# Altium project RX_Banda_Aerea.PrjPCB
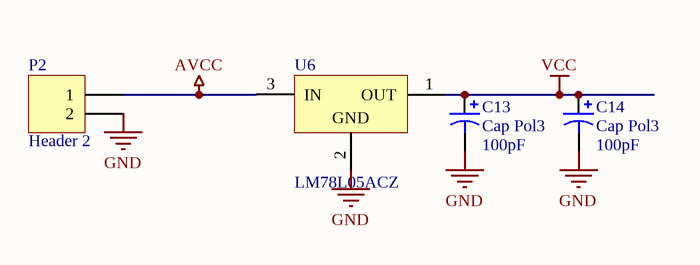
[diagram p0: Alimentacion.SchDoc]
7 sheets, 133 parts. Net scope: flat (ports and power ports of the same name join across sheets).
Board file: RX_Banda_Aerea.PcbDoc
Sheets:
  Alimentacion.SchDoc
  FiltroRF.SchDoc
  Ampli_RF.SchDoc
  Mezclador1.SchDoc
  Mezclador2.SchDoc
  Ampli_FI2.SchDoc
  Ampli_audio.SchDoc

## Sheet Alimentacion.SchDoc
size A4

### Parts
C13  Cap Pol3  value 100pF  [C0805]
C14  Cap Pol3  value 100pF  [C0805]
P2  Header 2  [HDR1X2]
U6  LM78L05ACZ  [Z03A]

### Nets
AVCC: P2.1 U6.3(IN)
GND: C13.2 C14.2 P2.2 U6.2(GND)
VCC: C13.1 C14.1 U6.1(OUT)

### Library data of the parts
C13 C14 = Cap Pol3: Polarized Capacitor (Surface Mount); Published: 8-Jun-2000; LatestRevisionDate: 17-Jul-2002; LatestRevisionNote: Re-released for DXP Platform.; PackageReference: C0805; Publisher: Altium Limited
P2 = Header 2: Header, 2-Pin; LatestRevisionDate: 17-Jul-2002; LatestRevisionNote: Re-released for DXP Platform.; Publisher: Altium Limited
U6 = LM78L05ACZ: 3-Terminal Positive Regulators; Manufacturer: National Semiconductor; CompType: LDO IC; PackageTopMarking: NSXYTT*LM78L*05ACZ; Published: 27-Nov-2008; DatasheetVersion: Apr-2006; PackageVersion: revG, Sep-2000; PackageReference: Z03A; Publisher: Altium Limited; PackageDescription: TO-92, Molded, 3 Lead; PartNumber: LM78L05ACZ; RoHS: O; PinCount: 3; DigiKeyPartNumber: LM78L05ACZNS-ND; Code_JEDEC: TO-226-AA; ComponentLink1Description: LM78L05 Datasheet; ComponentLink1URL: http://www.national.com/ds/LM/LM78L05.pdf; ComponentLink2Description: LM78L05 Web Page; ComponentLink2URL: http://www.national.com/pf/LM/LM78L05.html; ComponentLink3Description: Z03A Package Page; ComponentLink3URL: http://www.national.com/packaging/folders/z03a.html

## Sheet FiltroRF.SchDoc
size A4
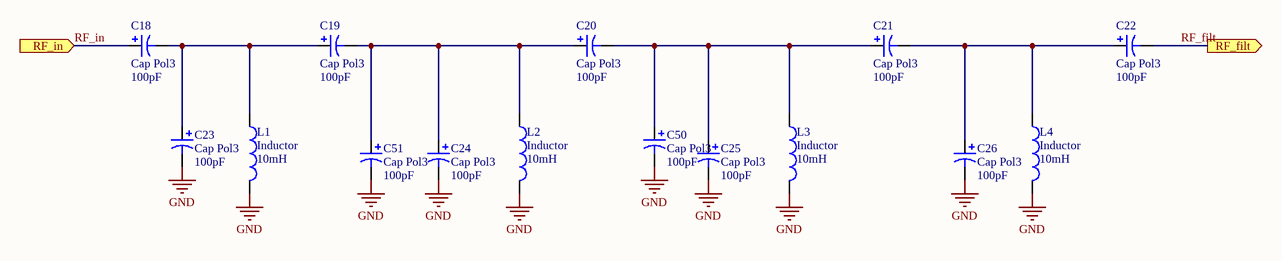
[diagram p1: FiltroRF.SchDoc]

### Parts
C18  Cap Pol3  value 100pF  [C0805]
C19  Cap Pol3  value 100pF  [C0805]
C20  Cap Pol3  value 100pF  [C0805]
C21  Cap Pol3  value 100pF  [C0805]
C22  Cap Pol3  value 100pF  [C0805]
C23  Cap Pol3  value 100pF  [C0805]
C24  Cap Pol3  value 100pF  [C0805]
C25  Cap Pol3  value 100pF  [C0805]
C26  Cap Pol3  value 100pF  [C0805]
C50  Cap Pol3  value 100pF  [C0805]
C51  Cap Pol3  value 100pF  [C0805]
L1  Inductor  value 10mH  [3261]
L2  Inductor  value 10mH  [3261]
L3  Inductor  value 10mH  [3261]
L4  Inductor  value 10mH  [3261]

### Ports
RF_filt (out), RF_in (in)

### Nets
GND: C23.2 C24.2 C25.2 C26.2 C50.2 C51.2 L1.2 L2.2 L3.2 L4.2
RF_filt: C22.2 ; port RF_filt
RF_in: C18.1 ; port RF_in
NetC18_2: C18.2 C19.1 C23.1 L1.1
NetC19_2: C19.2 C20.1 C24.1 C51.1 L2.1
NetC20_2: C20.2 C21.1 C25.1 C50.1 L3.1
NetC21_2: C21.2 C22.1 C26.1 L4.1

### Library data of the parts
C18-C26 C50 C51 = Cap Pol3: Polarized Capacitor (Surface Mount); Published: 8-Jun-2000; LatestRevisionDate: 17-Jul-2002; LatestRevisionNote: Re-released for DXP Platform.; PackageReference: C0805; Publisher: Altium Limited
L1-L4 = Inductor: Code_IEC: 1005; Published: 8-Jun-2000; LatestRevisionDate: 17-Jul-2002; LatestRevisionNote: Re-released for DXP Platform.; PackageReference: 0402-A; Publisher: Altium Limited; Code_JEITA: 0402

## Sheet Ampli_RF.SchDoc
size A4
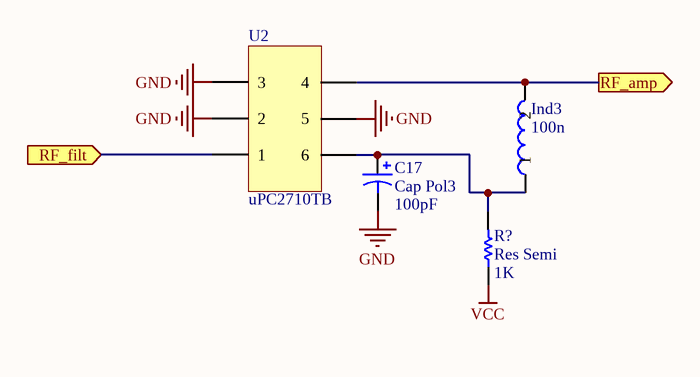
[diagram p2: Ampli_RF.SchDoc]

### Parts
(Parts that share a designator on the sheet are numbered #1, #2 ... from top to bottom, then left to right.)
C17  Cap Pol3  value 100pF  [C0805]
Ind3  Valor: 100n  [NTH12_2]  (hidden comment: Ind2)
R?#1  Res Semi  value 1K  [2012[0805]]
U2  uPC2710TB  [UPC2710TB2]

### Ports
RF_amp (out), RF_filt (in)

### Nets
GND: C17.2 U2.GND1(2) U2.GND2(3) U2.GND3(5)
VCC: R?#1.1
RF_amp: Ind3.2 U2.RF_OUT(4) ; port RF_amp
RF_filt: U2.RF_IN(1) ; port RF_filt
NetC17_1: C17.1 Ind3.1 R?#1.2 U2.Vcc(6)

### Library data of the parts
C17 = Cap Pol3: Polarized Capacitor (Surface Mount); Published: 8-Jun-2000; LatestRevisionDate: 17-Jul-2002; LatestRevisionNote: Re-released for DXP Platform.; PackageReference: C0805; Publisher: Altium Limited
R?#1 = Res Semi: Semiconductor Resistor; Published: 8-Jun-2000; LatestRevisionDate: 17-Jul-2002; LatestRevisionNote: Re-released for DXP Platform.; PackageReference: AXIAL-0.5; Publisher: Altium Limited
U2 = uPC2710TB: pin to pad: GND1>2 GND2>3 GND3>5 RF_IN>1 RF_OUT>4 Vcc>6

## Sheet Mezclador1.SchDoc
size A4
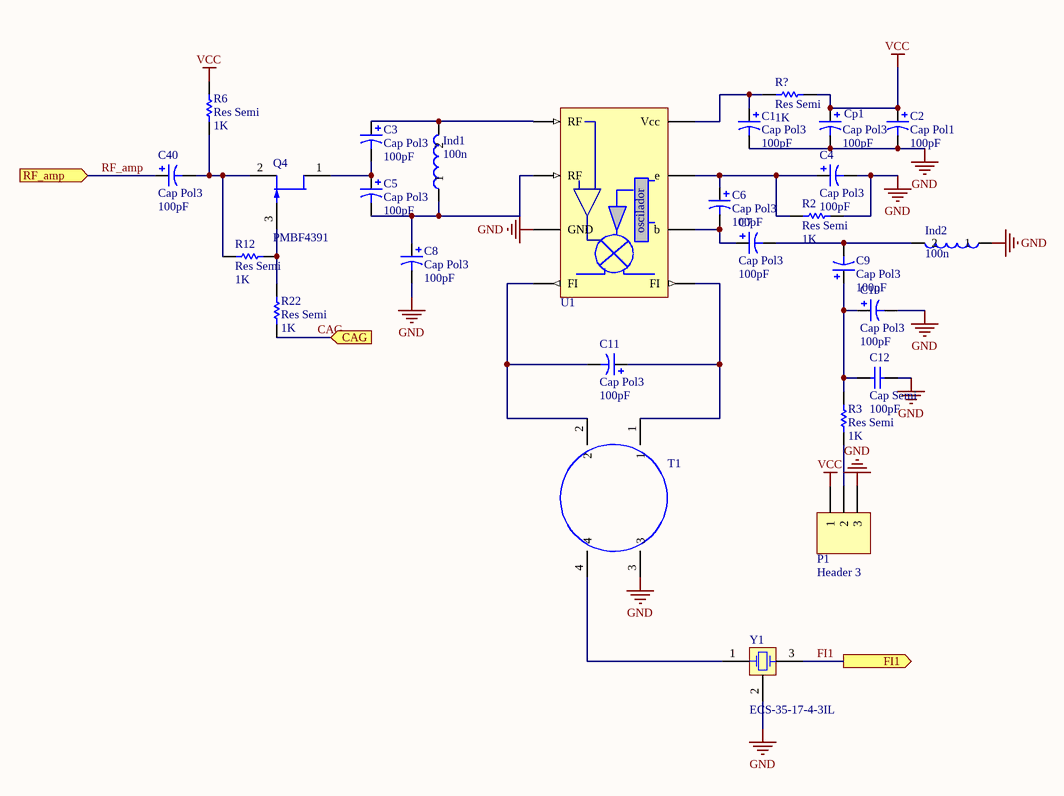
[diagram p3: Mezclador1.SchDoc]

### Parts
(Parts that share a designator on the sheet are numbered #1, #2 ... from top to bottom, then left to right.)
C1  Cap Pol3  value 100pF  [C0805]
C2  Cap Pol1  value 100pF  [B]
C3  Cap Pol3  value 100pF  [C0805]
C4  Cap Pol3  value 100pF  [C0805]
C5  Cap Pol3  value 100pF  [C0805]
C6  Cap Pol3  value 100pF  [C0805]
C7  Cap Pol3  value 100pF  [C0805]
C8  Cap Pol3  value 100pF  [C0805]
C9  Cap Pol3  value 100pF  [C0805]
C10  Cap Pol3  value 100pF  [C0805]
C11  Cap Pol3  value 100pF  [C0805]
C12  Cap Semi  value 100pF  [C1206]
C40  Cap Pol3  value 100pF  [C0805]
Cp1  Cap Pol3  value 100pF  [C0805]
Ind1  Valor: 100n  [Ind_5mm]  (hidden comment: Ind2)
Ind2  Valor: 100n  [Ind_4mm]  (hidden comment: Ind2)
P1  Header 3  [HDR1X3]
Q4  PMBF4391  [SOT23_N]
R2  Res Semi  value 1K  [2012[0805]]
R3  Res Semi  value 1K  [2012[0805]]
R6  Res Semi  value 1K  [2012[0805]]
R12  Res Semi  value 1K  [2012[0805]]
R22  Res Semi  value 1K  [2012[0805]]
R?#2  Res Semi  value 1K  [2012[0805]]
T1  Toroide  [NTH12_4]  (value not drawn)
U1  SA602  [SA602]  (value not drawn)
Y1  ECS-35-17-4-3IL  [HC-49US]

### Ports
CAG (in), FI1 (out), RF_amp (in)

### Nets
GND: C1.2 C2.2 C4.2 C8.2 C10.2 C12.2 Cp1.2 Ind2.1 P1.3 R2.1 T1.3 U1.3(GND) Y1.2(COM)
VCC: C2.1 Cp1.1 P1.1 R6.2 R?#2.2
CAG: R22.2 ; port CAG
FI1: Y1.3(OSC2) ; port FI1
RF_amp: C40.1 ; port RF_amp
NetC1_1: C1.1 R?#2.1 U1.8(Vcc)
NetC3_1: C3.1 Ind1.2 U1.1(RF)
NetC3_2: C3.2 C5.1 Q4.1(D)
NetC4_1: C4.1 C6.1 R2.2 U1.7(e)
NetC5_2: C5.2 C8.1 Ind1.1 U1.2(RF)
NetC6_2: C6.2 C7.1 U1.6(b)
NetC7_2: C7.2 C9.2 Ind2.2
NetC9_1: C9.1 C10.1 C12.1 R3.2
NetC11_1: C11.1 T1.1 U1.5(FI)
NetC11_2: C11.2 T1.2 U1.4(FI)
NetC40_2: C40.2 Q4.2(S) R6.1 R12.1
NetP1_2: P1.2 R3.1
NetQ4_3: Q4.3(G) R12.2 R22.1
NetT1_4: T1.4 Y1.1(OSC1)

### Notes on the sheet
- (in symbol SA602A) oscilador

### Library data of the parts
C1 C3-C11 C40 Cp1 = Cap Pol3: Polarized Capacitor (Surface Mount); Published: 8-Jun-2000; LatestRevisionDate: 17-Jul-2002; LatestRevisionNote: Re-released for DXP Platform.; PackageReference: C0805; Publisher: Altium Limited
C2 = Cap Pol1: Polarized Capacitor (Radial); Published: 8-Jun-2000; LatestRevisionDate: 17-Jul-2002; LatestRevisionNote: Re-released for DXP Platform.; PackageReference: RB7.6-15; Publisher: Altium Limited
C12 = Cap Semi: Capacitor (Semiconductor SIM Model); Published: 8-Jun-2000; LatestRevisionDate: 17-Jul-2002; LatestRevisionNote: Re-released for DXP Platform.; PackageReference: C1206; Publisher: Altium Limited
P1 = Header 3: Header, 3-Pin; LatestRevisionDate: 17-Jul-2002; LatestRevisionNote: Re-released for DXP Platform.; Publisher: Altium Limited
Q4 = PMBF4391: N-channel Silicon Junction Field-effect Transistor; Published: 17-Sep-2003; LatestRevisionDate: 12-Dec-2006; LatestRevisionNote: IPC-7351 Footprint Added.; DatasheetVersion: Apr-1995; PackageVersion: May-1999; PackageReference: SOT23; Publisher: Altium Limited; PackageDescription: 3-Pin SOT-23 Package 0.95 mm Pitch, 2.3 mm Lead Span; ComponentLink1Description: Manufacturer Link; ComponentLink1URL: http://www.semiconductors.philips.com/; ComponentLink2Description: Datasheet; ComponentLink2URL: http://www.semiconductors.philips.com/acrobat/datasheets/PMBF4391_4392_4393_CNV_2.pdf
R2 R3 R6 R12 R22 R?#2 = Res Semi: Semiconductor Resistor; Published: 8-Jun-2000; LatestRevisionDate: 17-Jul-2002; LatestRevisionNote: Re-released for DXP Platform.; PackageReference: AXIAL-0.5; Publisher: Altium Limited
T1 = Transformador_Toroide
U1 = SA602A: Mezclador 500MHz
Y1 = ECS-35-17-4-3IL: Crystal Oscillator, 3rd In-Line Lead Version; Published: 17-Jul-2002; DatasheetDocument: 18-Apr-2000; PackageReference: HC-49US; Publisher: Altium Limited; ComponentLink1Description: Manufacturer Link; ComponentLink1URL: http://www.ecsxtal.com/; ComponentLink2Description: Datasheet; ComponentLink2URL: http://www.ecsxtal.com/pdf3/HC_49US.pdf

## Sheet Mezclador2.SchDoc
size A4
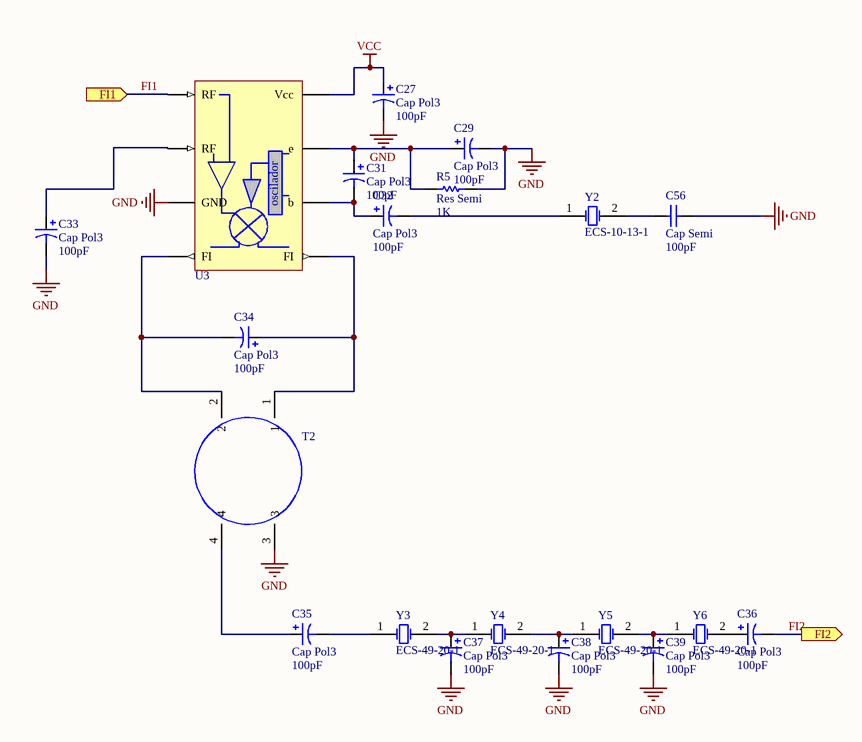
[diagram p4: Mezclador2.SchDoc]

### Parts
C27  Cap Pol3  value 100pF  [C0805]
C29  Cap Pol3  value 100pF  [C0805]
C31  Cap Pol3  value 100pF  [C0805]
C32  Cap Pol3  value 100pF  [C0805]
C33  Cap Pol3  value 100pF  [C0805]
C34  Cap Pol3  value 100pF  [C0805]
C35  Cap Pol3  value 100pF  [C0805]
C36  Cap Pol3  value 100pF  [C0805]
C37  Cap Pol3  value 100pF  [C0805]
C38  Cap Pol3  value 100pF  [C0805]
C39  Cap Pol3  value 100pF  [C0805]
C56  Cap Semi  value 100pF  [C1206]
R5  Res Semi  value 1K  [2012[0805]]
T2  Toroide  [NTH12_4]  (value not drawn)
U3  SA602  [SA602]  (value not drawn)
Y2  ECS-10-13-1  [HC-49U]
Y3  ECS-49-20-1  [HC-49U]
Y4  ECS-49-20-1  [HC-49U]
Y5  ECS-49-20-1  [HC-49U]
Y6  ECS-49-20-1  [HC-49U]

### Ports
FI1 (in), FI2 (out)

### Nets
GND: C27.2 C29.2 C33.2 C37.2 C38.2 C39.2 C56.2 R5.1 T2.3 U3.3(GND)
VCC: C27.1 U3.8(Vcc)
FI1: U3.1(RF) ; port FI1
FI2: C36.2 ; port FI2
NetC29_1: C29.1 C31.1 R5.2 U3.7(e)
NetC31_2: C31.2 C32.1 U3.6(b)
NetC32_2: C32.2 Y2.1(OSC1)
NetC33_1: C33.1 U3.2(RF)
NetC34_1: C34.1 T2.1 U3.5(FI)
NetC34_2: C34.2 T2.2 U3.4(FI)
NetC35_1: C35.1 T2.4
NetC35_2: C35.2 Y3.1(OSC1)
NetC36_1: C36.1 Y6.2(OSC2)
NetC37_1: C37.1 Y3.2(OSC2) Y4.1(OSC1)
NetC38_1: C38.1 Y4.2(OSC2) Y5.1(OSC1)
NetC39_1: C39.1 Y5.2(OSC2) Y6.1(OSC1)
NetC56_1: C56.1 Y2.2(OSC2)

### Notes on the sheet
- (in symbol SA602A) oscilador

### Library data of the parts
C27 C29 C31-C39 = Cap Pol3: Polarized Capacitor (Surface Mount); Published: 8-Jun-2000; LatestRevisionDate: 17-Jul-2002; LatestRevisionNote: Re-released for DXP Platform.; PackageReference: C0805; Publisher: Altium Limited
C56 = Cap Semi: Capacitor (Semiconductor SIM Model); Published: 8-Jun-2000; LatestRevisionDate: 17-Jul-2002; LatestRevisionNote: Re-released for DXP Platform.; PackageReference: C1206; Publisher: Altium Limited
R5 = Res Semi: Semiconductor Resistor; Published: 8-Jun-2000; LatestRevisionDate: 17-Jul-2002; LatestRevisionNote: Re-released for DXP Platform.; PackageReference: AXIAL-0.5; Publisher: Altium Limited
T2 = Transformador_Toroide
U3 = SA602A: Mezclador 500MHz
Y2 = ECS-10-13-1: Crystal Oscillator; Published: 17-Jul-2002; DatasheetDocument: 18-Apr-2000; PackageReference: HC-49U; Publisher: Altium Limited; ComponentLink1Description: Manufacturer Link; ComponentLink1URL: http://www.ecsxtal.com/; ComponentLink2Description: Datasheet; ComponentLink2URL: http://www.ecsxtal.com/pdf2/HC49U.PDF
Y3-Y6 = ECS-49-20-1: Crystal Oscillator; Published: 17-Jul-2002; DatasheetDocument: 18-Apr-2000; PackageReference: HC-49U; Publisher: Altium Limited; ComponentLink1Description: Manufacturer Link; ComponentLink1URL: http://www.ecsxtal.com/; ComponentLink2Description: Datasheet; ComponentLink2URL: http://www.ecsxtal.com/pdf2/HC49U.PDF

## Sheet Ampli_FI2.SchDoc
size A4
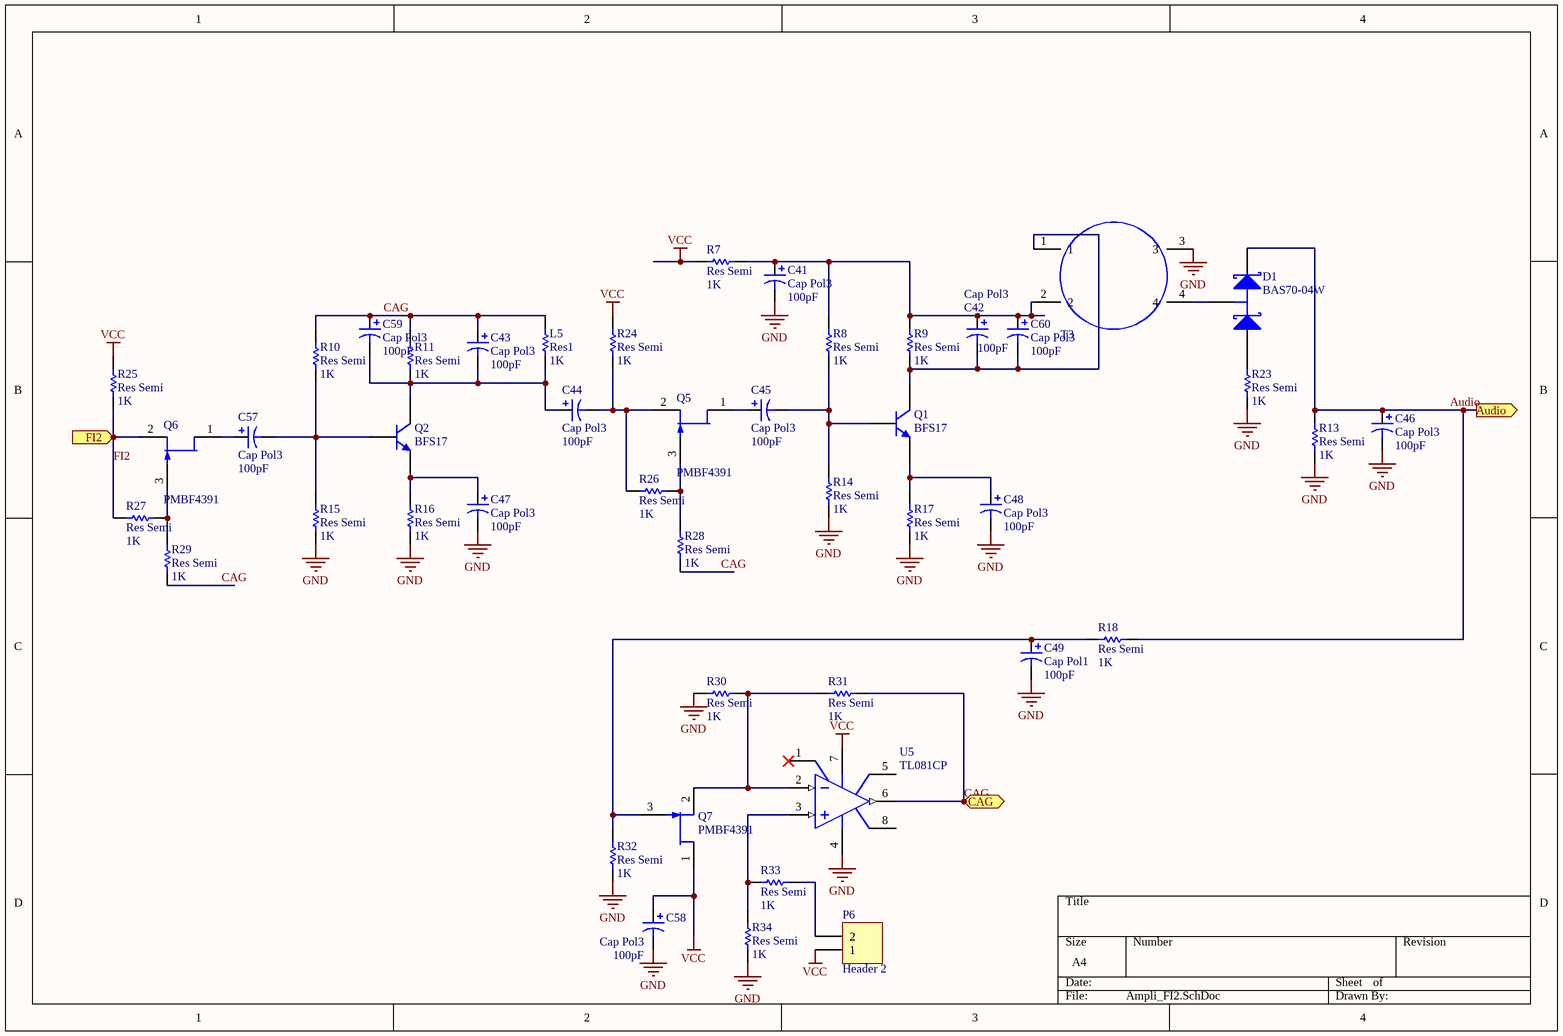
[diagram p5: Ampli_FI2.SchDoc]

### Parts
C41  Cap Pol3  value 100pF  [C0805]
C42  Cap Pol3  value 100pF  [C0805]
C43  Cap Pol3  value 100pF  [C0805]
C44  Cap Pol3  value 100pF  [C0805]
C45  Cap Pol3  value 100pF  [C0805]
C46  Cap Pol3  value 100pF  [C0805]
C47  Cap Pol3  value 100pF  [C0805]
C48  Cap Pol3  value 100pF  [C0805]
C49  Cap Pol1  value 100pF  [B]
C57  Cap Pol3  value 100pF  [C0805]
C58  Cap Pol3  value 100pF  [C0805]
C59  Cap Pol3  value 100pF  [C0805]
C60  Cap Pol3  value 100pF  [C0805]
D1  BAS70-04W  [SOT323_N]
L5  Res1  value 1K  [AXIAL-0.3]
P6  Header 2  [HDR1X2]
Q1  BFS17  [SOT23_N]
Q2  BFS17  [SOT23_N]
Q5  PMBF4391  [SOT23_N]
Q6  PMBF4391  [SOT23_N]
Q7  PMBF4391  [SOT23_N]
R7  Res Semi  value 1K  [2012[0805]]
R8  Res Semi  value 1K  [2012[0805]]
R9  Res Semi  value 1K  [2012[0805]]
R10  Res Semi  value 1K  [2012[0805]]
R11  Res Semi  value 1K  [2012[0805]]
R13  Res Semi  value 1K  [2012[0805]]
R14  Res Semi  value 1K  [2012[0805]]
R15  Res Semi  value 1K  [2012[0805]]
R16  Res Semi  value 1K  [2012[0805]]
R17  Res Semi  value 1K  [2012[0805]]
R18  Res Semi  value 1K  [2012[0805]]
R23  Res Semi  value 1K  [2012[0805]]
R24  Res Semi  value 1K  [2012[0805]]
R25  Res Semi  value 1K  [2012[0805]]
R26  Res Semi  value 1K  [2012[0805]]
R27  Res Semi  value 1K  [2012[0805]]
R28  Res Semi  value 1K  [2012[0805]]
R29  Res Semi  value 1K  [2012[0805]]
R30  Res Semi  value 1K  [2012[0805]]
R31  Res Semi  value 1K  [2012[0805]]
R32  Res Semi  value 1K  [2012[0805]]
R33  Res Semi  value 1K  [2012[0805]]
R34  Res Semi  value 1K  [2012[0805]]
T3  Toroide  [NTH12_4]  (value not drawn)
U5  TL081CP  [626-05]

### Ports
Audio (out), CAG (out), FI2 (in)

### Nets
GND: C41.2 C46.2 C47.2 C48.2 C49.2 C58.2 R13.1 R14.2 R15.1 R16.1 R17.2 R23.1 R30.1 R32.2 R34.2 T3.3 U5.4(V-)
VCC: C58.1 P6.1 Q7.1(D) R7.2 R24.2 R25.1 U5.7(V+)
Audio: C46.1 D1.2(K) R13.2 R18.1 ; port Audio
CAG: C43.1 C59.1 L5.2 R10.2 R11.2 R28.2 R29.2 R31.2 U5.6(OUT) ; port CAG
FI2: Q6.2(S) R25.2 R27.1 ; port FI2
NetC41_1: C41.1 C42.1 C60.1 R7.1 R8.1 R9.1 T3.2
NetC42_2: C42.2 C60.2 Q1.3(C) R9.2 T3.1
NetC43_2: C43.2 C44.1 C59.2 L5.1 Q2.3(C) R11.1
NetC44_2: C44.2 Q5.2(S) R24.1 R26.1
NetC45_1: C45.1 Q5.1(D)
NetC45_2: C45.2 Q1.1(B) R8.2 R14.1
NetC47_1: C47.1 Q2.2(E) R16.2
NetC48_1: C48.1 Q1.2(E) R17.1
NetC49_1: C49.1 Q7.3(G) R18.2 R32.1
NetC57_1: C57.1 Q6.1(D)
NetC57_2: C57.2 Q2.1(B) R10.1 R15.2
NetD1_1: D1.1(A) R23.2
NetD1_3: D1.3(C) T3.4
NetP6_2: P6.2 R33.1
NetQ5_3: Q5.3(G) R26.2 R28.1
NetQ6_3: Q6.3(G) R27.2 R29.1
NetQ7_2: Q7.2(S) R30.2 R31.1 U5.2(IN-)
NetR33_2: R33.2 R34.1 U5.3(IN+)

Not connected (* = marked no-connect by the designer): U5 1(OS_NULL)* 5(OS_NULL) 8(NC)

### Library data of the parts
C41-C48 C57-C60 = Cap Pol3: Polarized Capacitor (Surface Mount); Published: 8-Jun-2000; LatestRevisionDate: 17-Jul-2002; LatestRevisionNote: Re-released for DXP Platform.; PackageReference: C0805; Publisher: Altium Limited
C49 = Cap Pol1: Polarized Capacitor (Radial); Published: 8-Jun-2000; LatestRevisionDate: 17-Jul-2002; LatestRevisionNote: Re-released for DXP Platform.; PackageReference: RB7.6-15; Publisher: Altium Limited
D1 = BAS70-04W: Schottky Barrier Double Diode; Published: 17-Sep-2003; LatestRevisionDate: 12-Dec-2006; LatestRevisionNote: IPC-7351 Footprint Added.; DatasheetVersion: 26-Mar-1999; PackageVersion: Apr-1999; PackageReference: SOT323; Publisher: Altium Limited; PackageDescription: 3-Pin SOT-323 Package 0.65 mm Pitch, 2.1 mm Lead Span; ComponentLink1Description: Manufacturer Link; ComponentLink1URL: http://www.semiconductors.philips.com/; ComponentLink2Description: Datasheet; ComponentLink2URL: http://www.semiconductors.philips.com/acrobat/datasheets/BAS70W_3.pdf
L5 = Res1: Resistor; Published: 8-Jun-2000; LatestRevisionDate: 17-Jul-2002; LatestRevisionNote: Re-released for DXP Platform.; PackageReference: AXIAL-0.3; Publisher: Altium Limited
P6 = Header 2: Header, 2-Pin; LatestRevisionDate: 17-Jul-2002; LatestRevisionNote: Re-released for DXP Platform.; Publisher: Altium Limited
Q1 Q2 = BFS17: NPN 1 GHz Wideband Transistor; Published: 17-Sep-2003; LatestRevisionDate: 12-Dec-2006; LatestRevisionNote: IPC-7351 Footprint Added.; DatasheetVersion: Sep-1995; PackageVersion: May-1999; PackageReference: SOT23; Publisher: Altium Limited; PackageDescription: 3-Pin SOT-23 Package 0.95 mm Pitch, 2.3 mm Lead Span; ComponentLink1Description: Manufacturer Link; ComponentLink1URL: http://www.semiconductors.philips.com/; ComponentLink2Description: Datasheet; ComponentLink2URL: http://www.semiconductors.philips.com/acrobat/datasheets/BFS17_2.pdf
Q5-Q7 = PMBF4391: as Q4 on sheet Mezclador1; Published: 17-Sep-2003; LatestRevisionDate: 12-Dec-2006; LatestRevisionNote: IPC-7351 Footprint Added.; DatasheetVersion: Apr-1995; PackageVersion: May-1999; PackageReference: SOT23; Publisher: Altium Limited; PackageDescription: 3-Pin SOT-23 Package 0.95 mm Pitch, 2.3 mm Lead Span; ComponentLink1Description: Manufacturer Link; ComponentLink1URL: http://www.semiconductors.philips.com/; ComponentLink2Description: Datasheet; ComponentLink2URL: http://www.semiconductors.philips.com/acrobat/datasheets/PMBF4391_4392_4393_CNV_2.pdf
R7-R11 R13-R18 R23-R34 = Res Semi: Semiconductor Resistor; Published: 8-Jun-2000; LatestRevisionDate: 17-Jul-2002; LatestRevisionNote: Re-released for DXP Platform.; PackageReference: AXIAL-0.5; Publisher: Altium Limited
T3 = Transformador_Toroide
U5 = TL081CP: JFET-Input Operational Amplifier; Published: 17-Jul-2002; LatestRevisionDate: 06-Jun-2005; LatestRevisionNote: Stylized 3D Model Added.; DatasheetVersion: 1988; PackageReference: 626-05; Publisher: Altium Limited; PackageDescription: DIP; 8 Leads; Row Spacing 7.62 mm; Pitch 2.54 mm; ComponentLink1Description: Manufacturer Link; ComponentLink1URL: http://www.onsemi.com/site/products/parametrics/0,4446,251,00.html

## Sheet Ampli_audio.SchDoc
size A4
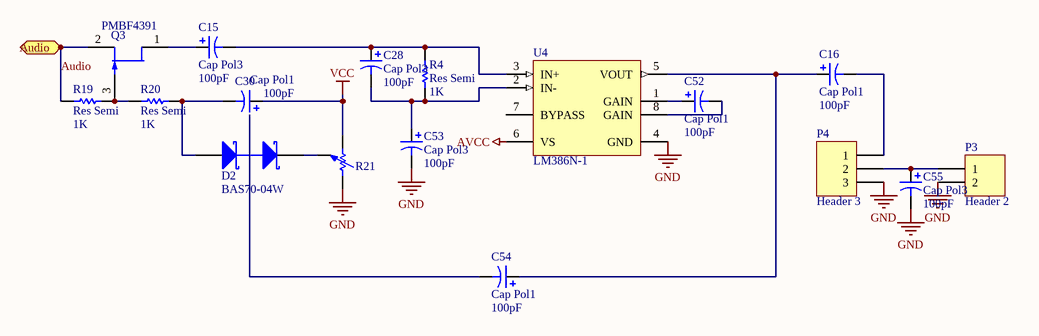
[diagram p6: Ampli_audio.SchDoc]

### Parts
C15  Cap Pol3  value 100pF  [C0805]
C16  Cap Pol1  value 100pF  [B]
C28  Cap Pol3  value 100pF  [C0805]
C30  Cap Pol1  value 100pF  [B]
C52  Cap Pol1  value 100pF  [B]
C53  Cap Pol3  value 100pF  [C0805]
C54  Cap Pol1  value 100pF  [B]
C55  Cap Pol3  value 100pF  [C0805]
D2  BAS70-04W  [SOT323_N]
P3  Header 2  [HDR1X2]
P4  Header 3  [HDR1X3]
Q3  PMBF4391  [SOT23_N]
R4  Res Semi  value 1K  [2012[0805]]
R19  Res Semi  value 1K  [2012[0805]]
R20  Res Semi  value 1K  [2012[0805]]
R21  Pot  [Potenciometro]  (value not drawn)
U4  LM386N-1  [N08E]

### Ports
Audio (in)

### Nets
AVCC: U4.6(VS)
GND: C53.2 C55.2 P3.2 P4.3 R21.1 U4.4(GND)
VCC: C30.1 R21.2
Audio: Q3.2(S) R19.1 ; port Audio
NetC15_1: C15.1 Q3.1(D)
NetC15_2: C15.2 C28.1 R4.2 U4.3(IN+)
NetC16_1: C16.1 C54.1 U4.5(VOUT)
NetC16_2: C16.2 P4.1
NetC28_2: C28.2 C53.1 R4.1 U4.2(IN-)
NetC30_2: C30.2 D2.1(A) R20.2
NetC52_1: C52.1 U4.1(GAIN)
NetC52_2: C52.2 U4.8(GAIN)
NetC54_2: C54.2 D2.3(C)
NetC55_1: C55.1 P3.1 P4.2
NetD2_2: D2.2(K) R21.3
NetQ3_3: Q3.3(G) R19.2 R20.1

Not connected (* = marked no-connect by the designer): U4 7(BYPASS)

### Library data of the parts
C15 C28 C53 C55 = Cap Pol3: Polarized Capacitor (Surface Mount); Published: 8-Jun-2000; LatestRevisionDate: 17-Jul-2002; LatestRevisionNote: Re-released for DXP Platform.; PackageReference: C0805; Publisher: Altium Limited
C16 C30 C52 C54 = Cap Pol1: Polarized Capacitor (Radial); Published: 8-Jun-2000; LatestRevisionDate: 17-Jul-2002; LatestRevisionNote: Re-released for DXP Platform.; PackageReference: RB7.6-15; Publisher: Altium Limited
D2 = BAS70-04W: Schottky Barrier Double Diode; Published: 17-Sep-2003; LatestRevisionDate: 12-Dec-2006; LatestRevisionNote: IPC-7351 Footprint Added.; DatasheetVersion: 26-Mar-1999; PackageVersion: Apr-1999; PackageReference: SOT323; Publisher: Altium Limited; PackageDescription: 3-Pin SOT-323 Package 0.65 mm Pitch, 2.1 mm Lead Span; ComponentLink1Description: Manufacturer Link; ComponentLink1URL: http://www.semiconductors.philips.com/; ComponentLink2Description: Datasheet; ComponentLink2URL: http://www.semiconductors.philips.com/acrobat/datasheets/BAS70W_3.pdf
P3 = Header 2: Header, 2-Pin; LatestRevisionDate: 17-Jul-2002; LatestRevisionNote: Re-released for DXP Platform.; Publisher: Altium Limited
P4 = Header 3: Header, 3-Pin; LatestRevisionDate: 17-Jul-2002; LatestRevisionNote: Re-released for DXP Platform.; Publisher: Altium Limited
Q3 = PMBF4391: as Q4 on sheet Mezclador1; Published: 17-Sep-2003; LatestRevisionDate: 12-Dec-2006; LatestRevisionNote: IPC-7351 Footprint Added.; DatasheetVersion: Apr-1995; PackageVersion: May-1999; PackageReference: SOT23; Publisher: Altium Limited; PackageDescription: 3-Pin SOT-23 Package 0.95 mm Pitch, 2.3 mm Lead Span; ComponentLink1Description: Manufacturer Link; ComponentLink1URL: http://www.semiconductors.philips.com/; ComponentLink2Description: Datasheet; ComponentLink2URL: http://www.semiconductors.philips.com/acrobat/datasheets/PMBF4391_4392_4393_CNV_2.pdf
R4 R19 R20 = Res Semi: Semiconductor Resistor; Published: 8-Jun-2000; LatestRevisionDate: 17-Jul-2002; LatestRevisionNote: Re-released for DXP Platform.; PackageReference: AXIAL-0.5; Publisher: Altium Limited
U4 = LM386N-1: Low Voltage Audio Power Amplifier; Manufacturer: National Semiconductor; CompType: Audio IC; PackageTopMarking: NSUZXYTT*LM*386N-1; Published: 27-Nov-2008; DatasheetVersion: Aug-2000; PackageVersion: revG, May-2006; PackageReference: N08E; PackageDescription: MDIP, .365 x .250 x .130in, 8 Lead, .100in Pitch; PartNumber: LM386N-1; RoHS: O; PinCount: 8; DigiKeyPartNumber: LM386N-1-ND; Code_JEDEC: MS-001-BA; ComponentLink1Description: LM386 Datasheet; ComponentLink1URL: http://www.national.com/ds/LM/LM386.pdf; ComponentLink2Description: LM386 Web Page; ComponentLink2URL: http://www.national.com/pf/LM/LM386.html; ComponentLink3Description: N08E Package Page; ComponentLink3URL: http://www.national.com/packaging/folders/n08e.html

## Nets that join several sheets
AVCC: Alimentacion (P2.1 U6.3), Ampli_audio (U4.6)
GND: Alimentacion (C13.2 C14.2 P2.2 U6.2), FiltroRF (10 pins), Ampli_RF (C17.2 U2.GND1 U2.GND2 U2.GND3), Mezclador1 (13 pins), Mezclador2 (10 pins), Ampli_FI2 (17 pins), Ampli_audio (6 pins)
VCC: Alimentacion (C13.1 C14.1 U6.1), Ampli_RF (R?#1.1), Mezclador1 (5 pins), Mezclador2 (C27.1 U3.8), Ampli_FI2 (7 pins), Ampli_audio (C30.1 R21.2)
Audio: Ampli_FI2 (C46.1 D1.2 R13.2 R18.1), Ampli_audio (Q3.2 R19.1)
CAG: Mezclador1 (R22.2), Ampli_FI2 (9 pins)
FI1: Mezclador1 (Y1.3), Mezclador2 (U3.1)
FI2: Mezclador2 (C36.2), Ampli_FI2 (Q6.2 R25.2 R27.1)
RF_amp: Ampli_RF (Ind3.2 U2.RF_OUT), Mezclador1 (C40.1)
RF_filt: FiltroRF (C22.2), Ampli_RF (U2.RF_IN)